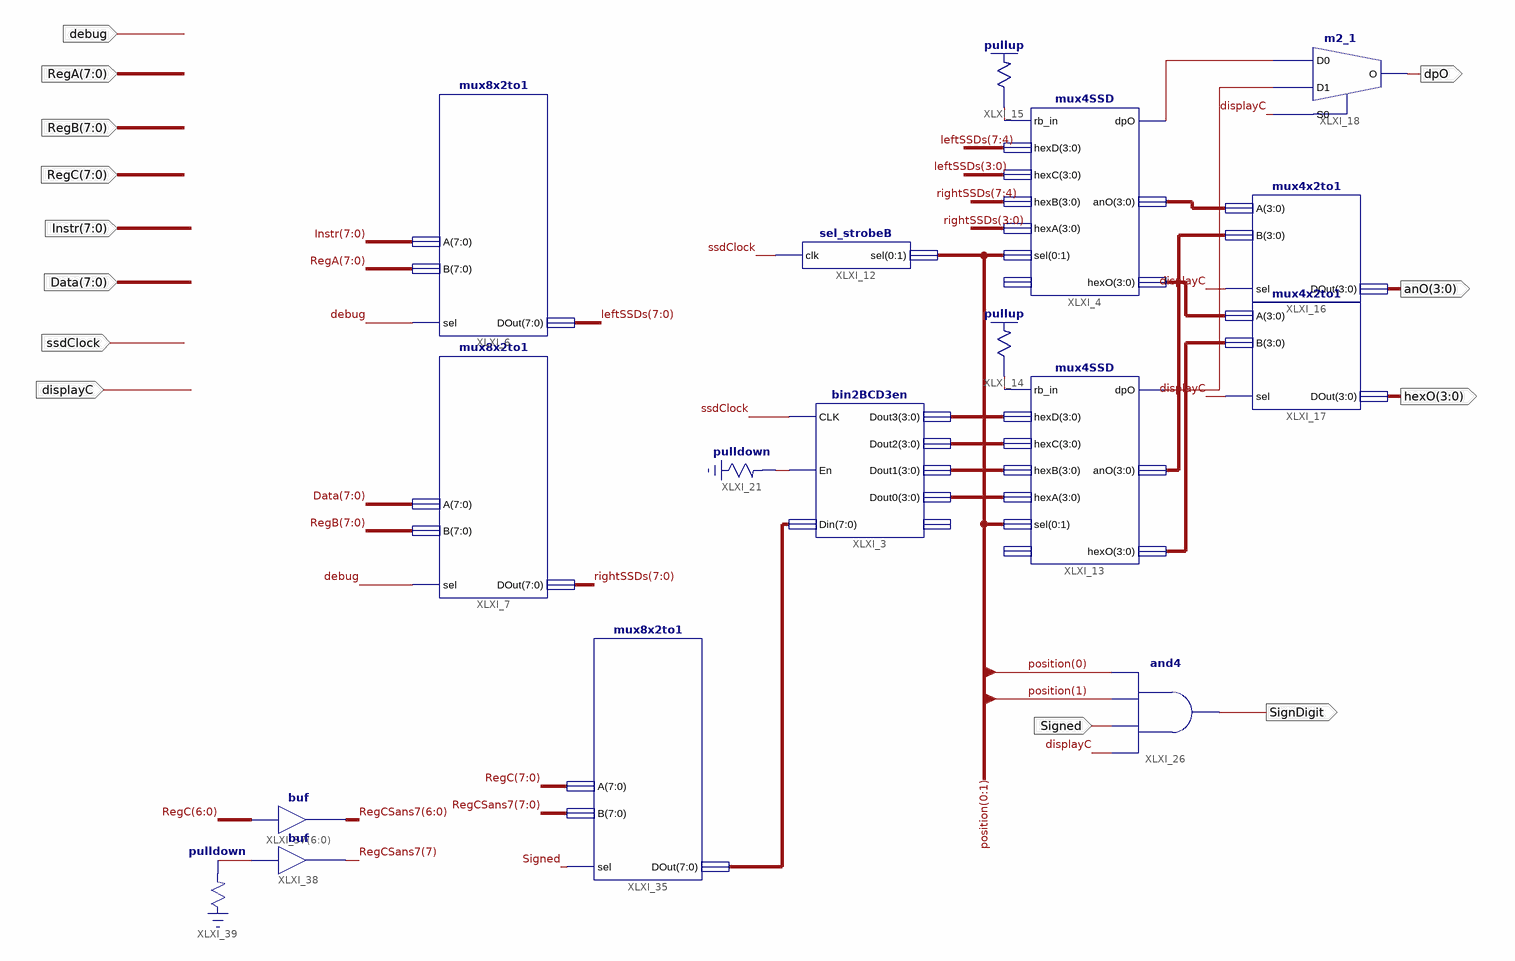
[diagram p0: schematic sheet 1]
// Xilinx ISE schematic DisplayNumbers.sch (spartan3e) as structural Verilog: 17 symbols, 13 ports
module DisplayNumbers (
  input  [7:0] RegA,
  input  [7:0] RegB,
  input  [7:0] RegC,
  input  [7:0] Instr,
  input  [7:0] Data,
  input  debug,
  input  ssdClock,
  input  displayC,
  input  Signed,
  output [3:0] anO,
  output [3:0] hexO,
  output dpO,
  output SignDigit
);

  wire XLXN_37, XLXN_38, XLXN_52, XLXN_59, XLXN_62, XLXN_80;
  wire [1:0] position;
  wire [3:0] XLXN_31, XLXN_32, XLXN_33, XLXN_34, XLXN_45, XLXN_46, XLXN_48, XLXN_58;
  wire [7:0] leftSSDs, RegCSans7, rightSSDs, XLXN_70;

  bin2BCD3en XLXI_3 (
    .CLK(ssdClock), .En(XLXN_62), .Din(XLXN_70), .Dout3(XLXN_31), .Dout2(XLXN_32), .Dout1(XLXN_33),
    .Dout0(XLXN_34));  // open: RBout
  mux4SSD XLXI_4 (
    .rb_in(XLXN_38), .hexD(leftSSDs[7:4]), .hexC(leftSSDs[3:0]), .hexB(rightSSDs[7:4]),
    .hexA(rightSSDs[3:0]), .sel({position[0], position[1]}), .dpO(XLXN_52), .anO(XLXN_58), .hexO(XLXN_46));  // open: dp_in
  mux8x2to1 XLXI_6 (.A(Instr), .B(RegA), .sel(debug), .DOut(leftSSDs));
  mux8x2to1 XLXI_7 (.A(Data), .B(RegB), .sel(debug), .DOut(rightSSDs));
  sel_strobeB XLXI_12 (.clk(ssdClock), .sel({position[0], position[1]}));
  mux4SSD XLXI_13 (
    .rb_in(XLXN_37), .hexD(XLXN_31), .hexC(XLXN_32), .hexB(XLXN_33), .hexA(XLXN_34),
    .sel({position[0], position[1]}), .dpO(XLXN_59), .anO(XLXN_45), .hexO(XLXN_48));  // open: dp_in
  \pullup  XLXI_14 (.O(XLXN_37));
  \pullup  XLXI_15 (.O(XLXN_38));
  m2_1 XLXI_18 (.D0(XLXN_52), .D1(XLXN_59), .S0(displayC), .O(dpO));
  mux4x2to1 XLXI_16 (.A(XLXN_58), .B(XLXN_45), .sel(displayC), .DOut(anO));
  mux4x2to1 XLXI_17 (.A(XLXN_46), .B(XLXN_48), .sel(displayC), .DOut(hexO));
  \pulldown  XLXI_21 (.O(XLXN_62));
  and XLXI_26 (SignDigit, displayC, Signed, position[1], position[0]);
  mux8x2to1 XLXI_35 (.A(RegC), .B(RegCSans7), .sel(Signed), .DOut(XLXN_70));
  assign RegCSans7[6:0] = RegC[6:0];  // buf XLXI_37[6..0], 7 bits wide
  buf XLXI_38 (RegCSans7[7], XLXN_80);
  \pulldown  XLXI_39 (.O(XLXN_80));
endmodule
